# Altium schematic sheet nRF5340.SchDoc
size A4; SheetNumber: 2; SheetTotal: 10
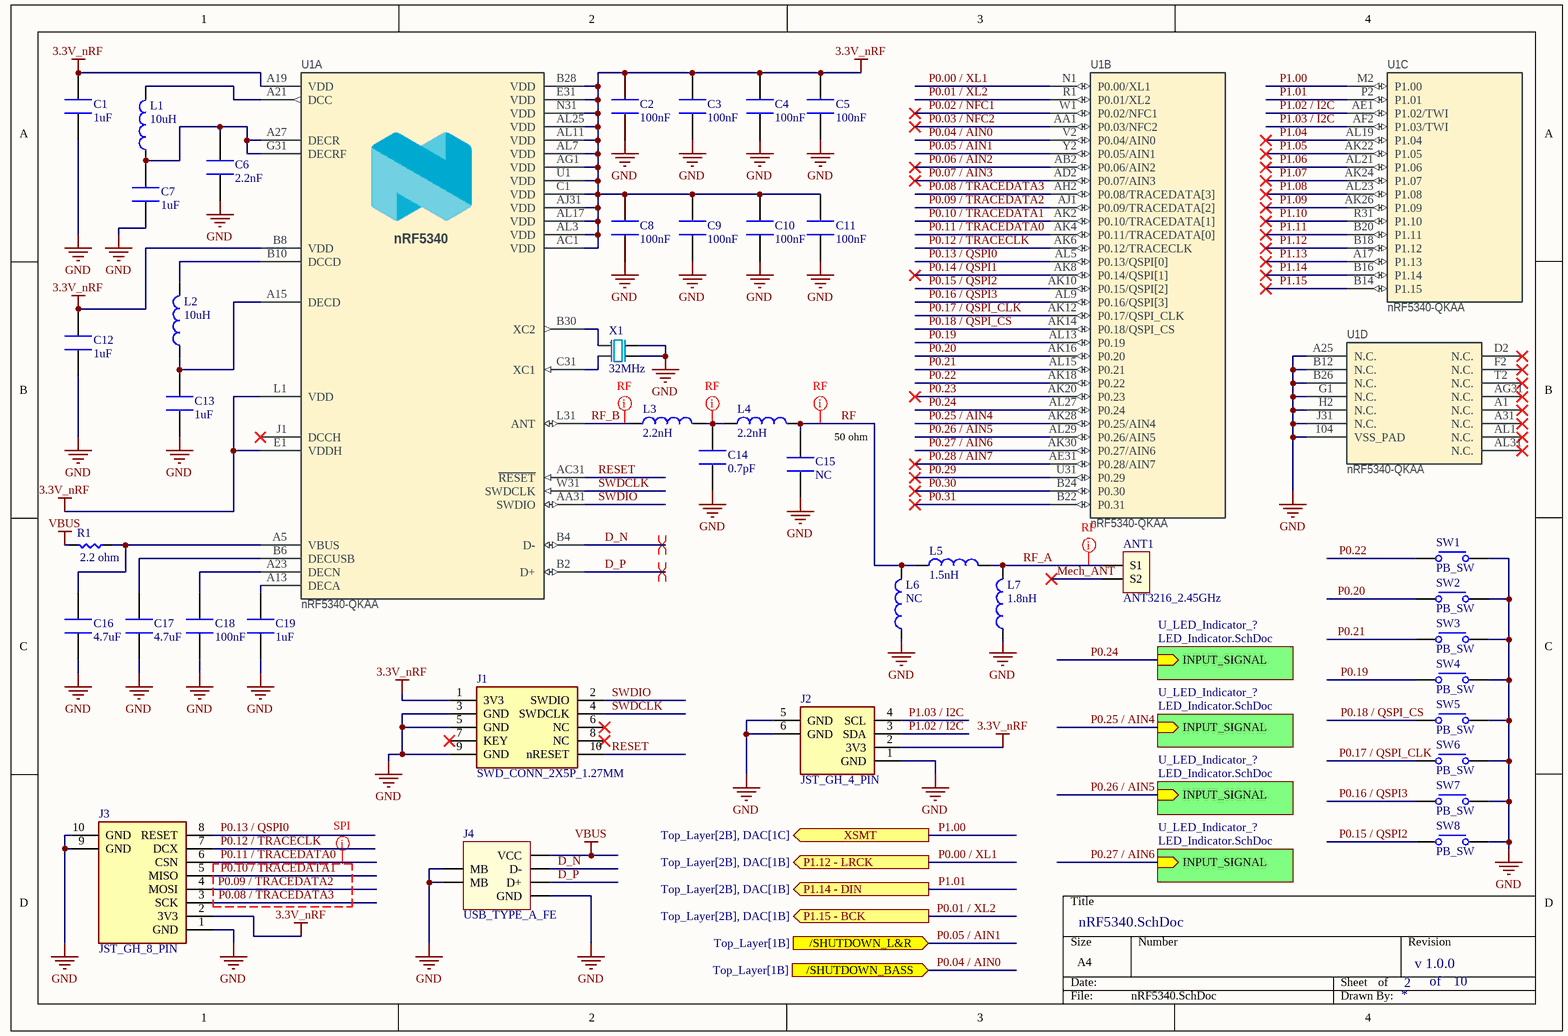
[diagram p0: nRF5340.SchDoc]

## Parts
ANT1  ANT3216_2.45GHz  [ANT3216_2.4GHz]
C1  1uF  [CAPC0402X06N]
C2  100nF  [CAPC0201X03N]
C3  100nF  [CAPC0201X03N]
C4  100nF  [CAPC0201X03N]
C5  100nF  [CAPC0201X03N]
C6  2.2nF  [CAPC0201X03N]
C7  1uF  [CAPC0402X06N]
C8  100nF  [CAPC0201X03N]
C9  100nF  [CAPC0201X03N]
C10  100nF  [CAPC0201X03N]
C11  100nF  [CAPC0201X03N]
C12  1uF  [CAPC0402X06N]
C13  1uF  [CAPC0402X06N]
C14  0.7pF  [CAPC0201X03N]
C15  NC  [CAPC0201X03N]
C16  4.7uF  [CAP0805X13N]
C17  4.7uF  [CAP0805X13N]
C18  100nF  [CAPC0201X03N]
C19  1uF  [CAPC0402X06N]
J1  SWD_CONN_2X5P_1.27MM  [CONN_2X5P_1.27MM - duplicate]
J2  JST_GH_4_PIN  [JST_GH_4_PIN]
J3  JST_GH_8_PIN  [JST_GH_8_PIN]
J4  USB_TYPE_A_FE  [USB_TYPE_A_FE]
L1  10uH  [INDC0603X08N]
L2  10uH  [INDC0603X08N]
L3  2.2nH  [INDC0201]
L4  2.2nH  [INDC0201]
L5  1.5nH  [INDC0201]
L6  NC  [INDC0201]  (no BOM)
L7  1.8nH  [INDC0201]
R1  2.2 ohm  [CAPC0201X03N]
SW1  PB_SW  [SW_PB_2]
SW2  PB_SW  [SW_PB_2]
SW3  PB_SW  [SW_PB_2]
SW4  PB_SW  [SW_PB_2]
SW5  PB_SW  [SW_PB_2]
SW6  PB_SW  [SW_PB_2]
SW7  PB_SW  [SW_PB_2]
SW8  PB_SW  [SW_PB_2]
U1  nRF5340-QKAA  [AQFN40P700X700X85_HS-99N]  (parts A,B,C,D of 4)
X1  32MHz  [CRYOSC_3.2X2.5M]

## Sub-sheets
U_LED_Indicator_? = LED_Indicator.SchDoc: INPUT_SIGNAL (in)
U_LED_Indicator_? = LED_Indicator.SchDoc: INPUT_SIGNAL (in)
U_LED_Indicator_? = LED_Indicator.SchDoc: INPUT_SIGNAL (in)
U_LED_Indicator_? = LED_Indicator.SchDoc: INPUT_SIGNAL (in)

## Ports
/SHUTDOWN_BASS (in, see Top_Layer[1B]), /SHUTDOWN_L&R (in, see Top_Layer[1B]), P1.12 - LRCK (out, see Top_Layer[2B], DAC[1B]), P1.14 - DIN (out, see Top_Layer[2B], DAC[1B]), P1.15 - BCK (out, see Top_Layer[2B], DAC[1B]), XSMT (out, see Top_Layer[2B], DAC[1C])

## Nets
3.3V_nRF: C1.2 C2.2 C3.2 C4.2 C5.2 C8.2 C9.2 C10.2 C11.2 C12.2 J1.1(3V3) J2.2(3V3) J3.2(3V3) U1.A19(VDD) U1.AC1(VDD) U1.AG1(VDD) U1.AJ31(VDD) U1.AL3(VDD) U1.AL7(VDD) U1.AL11(VDD) U1.AL17(VDD) U1.AL25(VDD) U1.B8(VDD) U1.B28(VDD) U1.C1(VDD) U1.E1(VDDH) U1.E31(VDD) U1.L1(VDD) U1.N31(VDD) U1.U1(VDD)
GND: C1.1 C2.1 C3.1 C4.1 C5.1 C6.1 C7.1 C8.1 C9.1 C10.1 C11.1 C12.1 C13.1 C14.2 C15.2 C16.1 C17.1 C18.1 C19.1 J1.3(GND) J1.5(GND) J1.9(GND) J2.1(GND) J2.5(GND) J2.6(GND) J3.1(GND) J3.9(GND) J3.10(GND) J4.4(GND) J4.5(MB) J4.6(MB) L6.1 L7.1 SW1.2 SW2.2 SW3.2 SW4.2 SW5.2 SW6.2 SW7.2 SW8.2 U1.104(VSS_PAD) U1.A25(N.C.) U1.B12(N.C.) U1.B26(N.C.) U1.G1(N.C.) U1.H2(N.C.) U1.J31(N.C.) X1.2(GND1) X1.4(GND2)
VBUS: J4.1(VCC) R1.2
D_N: J4.2(D-) U1.B4(D-)
D_P: J4.3(D+) U1.B2(D+)
Mech_ANT: ANT1.2(S2)
P0.00 / XL1: U1.N1(P0.00/XL1) ; port P1.12 - LRCK
P0.01 / XL2: U1.R1(P0.01/XL2) ; port P1.15 - BCK
P0.02 / NFC1: U1.W1(P0.02/NFC1)
P0.03 / NFC2: U1.AA1(P0.03/NFC2)
P0.04 / AIN0: U1.V2(P0.04/AIN0) ; port /SHUTDOWN_BASS
P0.05 / AIN1: U1.Y2(P0.05/AIN1) ; port /SHUTDOWN_L&R
P0.06 / AIN2: U1.AB2(P0.06/AIN2)
P0.07 / AIN3: U1.AD2(P0.07/AIN3)
P0.08 / TRACEDATA3: J3.3(SCK) U1.AH2(P0.08/TRACEDATA[3])
P0.09 / TRACEDATA2: J3.4(MOSI) U1.AJ1(P0.09/TRACEDATA[2])
P0.10 / TRACEDATA1: J3.5(MISO) U1.AK2(P0.10/TRACEDATA[1])
P0.11 / TRACEDATA0: J3.6(CSN) U1.AK4(P0.11/TRACEDATA[0])
P0.12 / TRACECLK: J3.7(DCX) U1.AK6(P0.12/TRACECLK)
P0.13 / QSPI0: J3.8(RESET) U1.AL5(P0.13/QSPI[0])
P0.14 / QSPI1: U1.AK8(P0.14/QSPI[1])
P0.15 / QSPI2: SW8.1 U1.AK10(P0.15/QSPI[2])
P0.16 / QSPI3: SW7.1 U1.AL9(P0.16/QSPI[3])
P0.17 / QSPI_CLK: SW6.1 U1.AK12(P0.17/QSPI_CLK)
P0.18 / QSPI_CS: SW5.1 U1.AK14(P0.18/QSPI_CS)
P0.19: SW4.1 U1.AL13(P0.19)
P0.20: SW2.1 U1.AK16(P0.20)
P0.21: SW3.1 U1.AL15(P0.21)
P0.22: SW1.1 U1.AK18(P0.22)
P0.23: U1.AK20(P0.23)
P0.24: U1.AL27(P0.24) ; sheet U_LED_Indicator_?/INPUT_SIGNAL
P0.25 / AIN4: U1.AK28(P0.25/AIN4) ; sheet U_LED_Indicator_?/INPUT_SIGNAL
P0.26 / AIN5: U1.AL29(P0.26/AIN5) ; sheet U_LED_Indicator_?/INPUT_SIGNAL
P0.27 / AIN6: U1.AK30(P0.27/AIN6) ; sheet U_LED_Indicator_?/INPUT_SIGNAL
P0.28 / AIN7: U1.AE31(P0.28/AIN7)
P0.29: U1.U31(P0.29)
P0.30: U1.B24(P0.30)
P0.31: U1.B22(P0.31)
P1.00: U1.M2(P1.00) ; port XSMT
P1.01: U1.P2(P1.01) ; port P1.14 - DIN
P1.02 / I2C: J2.3(SDA) U1.AE1(P1.02/TWI)
P1.03 / I2C: J2.4(SCL) U1.AF2(P1.03/TWI)
P1.04: U1.AL19(P1.04)
P1.05: U1.AK22(P1.05)
P1.06: U1.AL21(P1.06)
P1.07: U1.AK24(P1.07)
P1.08: U1.AL23(P1.08)
P1.09: U1.AK26(P1.09)
P1.10: U1.R31(P1.10)
P1.11: U1.B20(P1.11)
P1.12: U1.B18(P1.12)
P1.13: U1.A17(P1.13)
P1.14: U1.B16(P1.14)
P1.15: U1.B14(P1.15)
RESET: J1.10(nRESET) U1.AC31(~{RESET})
RF: C15.1 L4.2 L5.1 L6.2
RF_A: ANT1.1(S1) L5.2 L7.2
RF_B: L3.1 U1.L31(ANT)
SWDCLK: J1.4(SWDCLK) U1.W31(SWDCLK)
SWDIO: J1.2(SWDIO) U1.AA31(SWDIO)
NetC6_2: C6.2 C7.2 L1.1 U1.A27(DECR) U1.G31(DECRF)
NetC13_2: C13.2 L2.1 U1.A15(DECD)
NetC14_1: C14.1 L3.2 L4.1
NetC16_2: C16.2 R1.1 U1.A5(VBUS)
NetC17_2: C17.2 U1.B6(DECUSB)
NetC18_2: C18.2 U1.A23(DECN)
NetC19_2: C19.2 U1.A13(DECA)
NetL1_2: L1.2 U1.A21(DCC)
NetL2_2: L2.2 U1.B10(DCCD)
NetU1_B30: U1.B30(XC2) X1.1(CLK1)
NetU1_C31: U1.C31(XC1) X1.3(CLK2)

Not connected (* = marked no-connect by the designer): J1 6(NC)* 7(KEY)* 8(NC)*; U1 A1(N.C.)* A31(N.C.)* AG31(N.C.)* AL1(N.C.)* AL31(N.C.)* D2(N.C.)* F2(N.C.)* J1(DCCH)* T2(N.C.)*

## Layout directives
differential pair: D_N, D_P
net class RF: NetC14_1, RF, RF_A, RF_B
net class SPI: P0.08 / TRACEDATA3, P0.09 / TRACEDATA2, P0.10 / TRACEDATA1

## Notes on the sheet
- 50 ohm
- v 1.0.0
- of
- (in symbol nRF5340-QKAA, part A) nRF5340

## Library data of the parts
ANT1 = ANT3216_2.45GHz: C293767, ANT3216LL00R2400A, -40℃~+105℃ 1.2mm 1.6mm 160MHz 1W 2.45GHz 3.2mm 5.05dBi 50Ω 1206 Antennas ROHS; Supplier 1: Verical; Supplier Part Number 1: ANT3216LL00R2400A
C1 C7 C12 C13 C19 = CC0402_1uF_X7R: C307427, CL05B105KQ5NQNC, 1uF 6.3V X7R ±10% 0402 Multilayer Ceramic Capacitors MLCC - SMD/SMT ROHS; Supplier 1: element14 APAC; Supplier Part Number 1: CL05B105KQ5NQNC
C2-C5 C8-C11 C18 = CC0201_100nF_X7R: C1882920, CC0201KRX7R5BB104, 100nF 6.3V X7R ±10% 0201 Multilayer Ceramic Capacitors MLCC - SMD/SMT ROHS; Supplier 1: element14 APAC; Supplier Part Number 1: CC0201KRX7R5BB104
C6 = CC0201_2.2nF_X7R: C161488. GRM033R71E222KA12D, 2.2nF 25V X7R ±10% 0201 Multilayer Ceramic Capacitors MLCC - SMD/SMT ROHS; Supplier 1: element14 APAC; Supplier Part Number 1: GRM033R71E222KA12D
C14 C15 = CC0201_0.7pF_COG: C907945, GJM0335C1ER70WB01D, 0.7pF 25V C0G 0201 Multilayer Ceramic Capacitors MLCC - SMD/SMT ROHS; Supplier 1: element14 APAC; Supplier Part Number 1: GJM0335C1ER70WB01D
C16 C17 = CC0805_4.7uF_X7R: C354262, CC0805KKX7R8BB475, 25V 4.7uF X7R ±10% 0805 Multilayer Ceramic Capacitors MLCC - SMD/SMT ROHS; Supplier 1: element14 APAC; Supplier Part Number 1: CC0805KKX7R8BB475
J1 = SWD_CONN_2X5P_1.27MM: C42372547, HX JN1.27-2x5P ZZ H4.9, -40℃~+105℃ 1.27mm 1.27mm 1A 2 2x5P 5 500V Black Copper Gold IDC Header Through Hole Plugin,P=1.27mm IDC Connectors ROHS; Supplier 1: Verical; Supplier Part Number 1: 3220-10-0100-00
J2 = JST_GH_4_PIN: C161692, BM04B-GHS-TBT(LF)(SN), -25℃~+85℃ 1 1.25mm 1A 1x4P 4 4.05mm 4.32mm 4P 50V 8.25mm Auxiliary Solder Pin GH PA9T Phosphor bronze Surface Mount,Vertical Tin UL94V-0 White SMD,P=1.25mm Wire To Board Connector ROHS; Supplier 1: CoreStaff; Supplier Part Number 1: ST74986991
J3 = JST_GH_8_PIN: C133062, BM08B-GHS-TBT(LF)(SN), -25℃~+85℃ 1 1.25mm 13.25mm 1A 1x8P 4.05mm 4.32mm 50V 8 8P Auxiliary Solder Pin GH PA9T Phosphor bronze Surface Mount,Vertical Tin UL94V-0 White SMD,P=1.25mm Wire To Board Connector ROHS; Supplier 1: Future Electronics; Supplier Part Number 1: BM08B-GHS-TBT(LF)(SN)
J4 = USB_TYPE_A_FE: C456018, AF 90 WJDG, -25℃~+85℃ 1 1.5A 14mm 30V 4P 5,000 times Female Right Angle Type-A USB 2.0 White 弯插 USB Connectors ROHS; Supplier 1: UnikeyIC; Supplier Part Number 1: AF 90 WJDG
L1 L2 = IN0603_10uH: C76798, MLZ1608M100WT000, 1.05Ω 10uH 250mA 2MHz 90mA Multilayer inductor ±20% 0603 Inductors (SMD) ROHS; Supplier 1: element14 APAC; Supplier Part Number 1: MLZ1608M100WT000
L3 L4 = IN0201_2.2nH: C98041, LQP03TN2N2B02D, 11GHz 14@500MHz 150mΩ 2.2nH 600mA Thick Film Inductor 0201 Inductors (SMD) ROHS; Supplier 1: element14 APAC; Supplier Part Number 1: LQP03TN2N2B02D
L5 = IN0201_1.5nH: C77114, LQP03TN1N5B02D, 1.5nH 14@500MHz 150mΩ 15GHz 600mA Thick Film Inductor 0201 Inductors (SMD) ROHS; Supplier 1: Future Electronics; Supplier Part Number 1: LQP03TN1N5B02D
L6 L7 = IN0201_1.8nH: C98040, LQP03TN1N8B02D, 1.8nH 14@500MHz 150mΩ 15GHz 600mA Thick Film Inductor 0201 Inductors (SMD) ROHS; Supplier 1: element14 APAC; Supplier Part Number 1: LQP03TN1N8B02D
R1 = REC0201_2.2_THICK: C474415, RC0201JR-072R2L, -100ppm/℃~+350ppm/℃ -55℃~+125℃ 2.2Ω 25V 50mW Thick Film Resistor ±5% 0201 Chip Resistor - Surface Mount ROHS; Supplier 1: element14 APAC; Supplier Part Number 1: RC0201JR-072R2L
SW1-SW8 = SW_SMD_PUSH: C49393629, R4A25211L, 1.8N 12V 50mA Gull Wing Rectangular Button SPST-NO Surface Mount,Vertical White SMD Pushbutton Switches ROHS
U1 = nRF5340-QKAA: Multi-protocol Bluetooth Low Energy, IEEE 802.15.4, ANT and 2.4GHz proprietary system-on-chip; Pad Count: 98; Footprint Doc: AQFN-98; Value: nRF5340-QKAA; Component Class: nRF_Devices; Supplier 1: DigiKey; Supplier Part Number 1: 4823-NRF5340-QKAA-RCT-ND; Supplier 2: DigiKey; Supplier Part Number 2: 4823-NRF5340-QKAA-R7CT-ND
X1 = SMD3225_4P_32MHz_OSC: C20617581, XL2MI-111-32M, -40℃~+85℃ 10pF 32MHz 40Ω Crystal Oscillator ±10ppm ±20ppm SMD3225-4P Crystals ROHS; Supplier 1: UnikeyIC; Supplier Part Number 1: XL2MI-111-32M